# Altium schematic sheet usb.schdoc: USB
size A4; Date: 09.30.2026; CheckedBy: BCY; DrawnBy: miaow; Revision: v1.0.0; SheetNumber: 10; SheetTotal: 18; BoardType: MAIN_PCB; Desc: Power in & USB 0/1
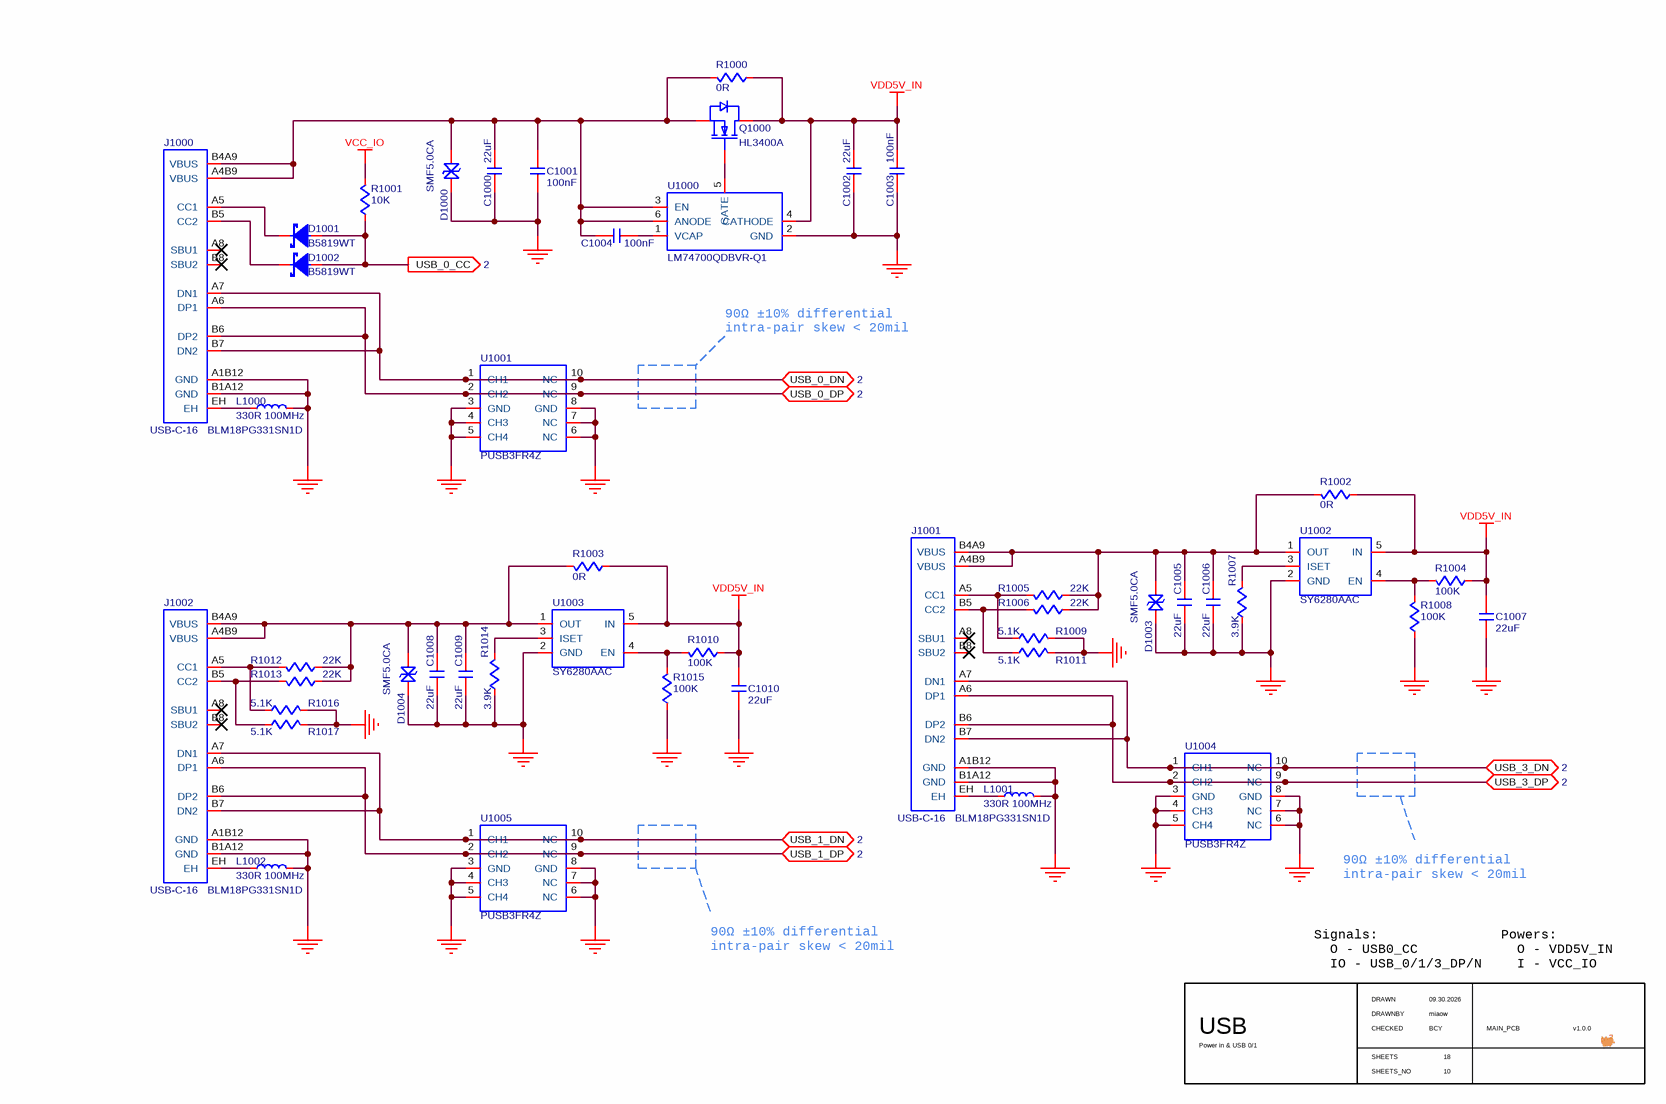
[diagram p0: usb.schdoc]

## Parts
C1000  value 22uF  [C0603]  (hidden comment: C-NOMO)
C1001  value 100nF  [C0402]  (hidden comment: C-NOMO)
C1002  value 22uF  [C0603]  (hidden comment: C-NOMO)
C1003  value 100nF  [C0402]  (hidden comment: C-NOMO)
C1004  value 100nF  [C0402]  (hidden comment: C-NOMO)
C1005  value 22uF  [C0603]  (hidden comment: C-NOMO)
C1006  value 22uF  [C0603]  (hidden comment: C-NOMO)
C1007  value 22uF  [C0603]  (hidden comment: C-NOMO)
C1008  value 22uF  [C0603]  (hidden comment: C-NOMO)
C1009  value 22uF  [C0603]  (hidden comment: C-NOMO)
C1010  value 22uF  [C0603]  (hidden comment: C-NOMO)
D1000  SMF5.0CA  [SMF5.0CA]
D1001  B5819WT  [B5819WT]
D1002  B5819WT  [B5819WT]
D1003  SMF5.0CA  [SMF5.0CA]
D1004  SMF5.0CA  [SMF5.0CA]
J1000  USB-C-16  [USB-C-16]
J1001  USB-C-16  [USB-C-16]
J1002  USB-C-16  [USB-C-16]
L1000  BLM18PG331SN1D  value 330R 100MHz  [L0603]
L1001  BLM18PG331SN1D  value 330R 100MHz  [L0603]
L1002  BLM18PG331SN1D  value 330R 100MHz  [L0603]
Q1000  HL3400A  [HL3400A]
R1000  value 0R  [R1206]  (hidden comment: R)
R1001  value 10K  [R0402]  (hidden comment: R)
R1002  value 0R  [R1206]  (hidden comment: R)
R1003  value 0R  [R1206]  (hidden comment: R)
R1004  value 100K  [R0402]  (hidden comment: R)
R1005  value 22K  [R0402]  (hidden comment: R)
R1006  value 22K  [R0402]  (hidden comment: R)
R1007  value 3.9K  [R0402]  (hidden comment: R)
R1008  value 100K  [R0402]  (hidden comment: R)
R1009  value 5.1K  [R0402]  (hidden comment: R)
R1010  value 100K  [R0402]  (hidden comment: R)
R1011  value 5.1K  [R0402]  (hidden comment: R)
R1012  value 22K  [R0402]  (hidden comment: R)
R1013  value 22K  [R0402]  (hidden comment: R)
R1014  value 3.9K  [R0402]  (hidden comment: R)
R1015  value 100K  [R0402]  (hidden comment: R)
R1016  value 5.1K  [R0402]  (hidden comment: R)
R1017  value 5.1K  [R0402]  (hidden comment: R)
U1000  LM74700QDBVR-Q1  [LM74700QDBVR-Q1]
U1001  PUSB3FR4Z  [PUSB3FR4Z]
U1002  SY6280AAC  [SY6280AAC]
U1003  SY6280AAC  [SY6280AAC]
U1004  PUSB3FR4Z  [PUSB3FR4Z]
U1005  PUSB3FR4Z  [PUSB3FR4Z]

## Ports
USB_0_CC (out, see 2), USB_0_DN (bidir, see 2), USB_0_DP (bidir, see 2), USB_1_DN (bidir, see 2), USB_1_DP (bidir, see 2), USB_3_DN (bidir, see 2), USB_3_DP (bidir, see 2)

## Nets
GND: C1000.1 C1001.2 C1002.1 C1003.2 C1005.1 C1006.1 C1007.2 C1008.1 C1009.1 C1010.2 D1000.1 D1003.1 D1004.1 J1000.A1B12(GND) J1000.B1A12(GND) J1001.A1B12(GND) J1001.B1A12(GND) J1002.A1B12(GND) J1002.B1A12(GND) L1000.2 L1001.2 L1002.2 R1007.2 R1008.2 R1009.1 R1011.1 R1014.2 R1015.2 R1016.1 R1017.1 U1000.2(GND) U1001.3(GND) U1001.4(CH3) U1001.5(CH4) U1001.6(NC) U1001.7(NC) U1001.8(GND) U1002.2(GND) U1003.2(GND) U1004.3(GND) U1004.4(CH3) U1004.5(CH4) U1004.6(NC) U1004.7(NC) U1004.8(GND) U1005.3(GND) U1005.4(CH3) U1005.5(CH4) U1005.6(NC) U1005.7(NC) U1005.8(GND)
VCC_IO: R1001.1
VDD5V_IN: C1002.2 C1003.1 C1007.1 C1010.1 Q1000.D R1000.2 R1002.2 R1003.2 R1004.2 R1010.2 U1000.4(CATHODE) U1002.5(IN) U1003.5(IN)
USB_0_CC: D1001.2 D1002.2 R1001.2 ; port USB_0_CC
USB_0_DN: J1000.A7(DN1) J1000.B7(DN2) U1001.1(CH1) U1001.10(NC) ; port USB_0_DN
USB_0_DP: J1000.A6(DP1) J1000.B6(DP2) U1001.2(CH2) U1001.9(NC) ; port USB_0_DP
USB_1_DN: J1002.A7(DN1) J1002.B7(DN2) U1005.1(CH1) U1005.10(NC) ; port USB_1_DN
USB_1_DP: J1002.A6(DP1) J1002.B6(DP2) U1005.2(CH2) U1005.9(NC) ; port USB_1_DP
USB_3_DN: J1001.A7(DN1) J1001.B7(DN2) U1004.1(CH1) U1004.10(NC) ; port USB_3_DN
USB_3_DP: J1001.A6(DP1) J1001.B6(DP2) U1004.2(CH2) U1004.9(NC) ; port USB_3_DP
NetC1000_2: C1000.2 C1001.1 C1004.2 D1000.2 J1000.A4B9(VBUS) J1000.B4A9(VBUS) Q1000.S R1000.1 U1000.3(EN) U1000.6(ANODE)
NetC1004_1: C1004.1 U1000.1(VCAP)
NetC1005_2: C1005.2 C1006.2 D1003.2 J1001.A4B9(VBUS) J1001.B4A9(VBUS) R1002.1 R1005.2 R1006.2 U1002.1(OUT)
NetC1008_2: C1008.2 C1009.2 D1004.2 J1002.A4B9(VBUS) J1002.B4A9(VBUS) R1003.1 R1012.2 R1013.2 U1003.1(OUT)
NetD1001_1: D1001.1 J1000.A5(CC1)
NetD1002_1: D1002.1 J1000.B5(CC2)
NetJ1000_EH: J1000.EH L1000.1
NetJ1001_A5: J1001.A5(CC1) R1005.1 R1009.2
NetJ1001_B5: J1001.B5(CC2) R1006.1 R1011.2
NetJ1001_EH: J1001.EH L1001.1
NetJ1002_A5: J1002.A5(CC1) R1012.1 R1016.2
NetJ1002_B5: J1002.B5(CC2) R1013.1 R1017.2
NetJ1002_EH: J1002.EH L1002.1
NetQ1000_G: Q1000.G U1000.5(GATE)
NetR1004_1: R1004.1 R1008.1 U1002.4(EN)
NetR1007_1: R1007.1 U1002.3(ISET)
NetR1010_1: R1010.1 R1015.1 U1003.4(EN)
NetR1014_1: R1014.1 U1003.3(ISET)

Not connected (* = marked no-connect by the designer): J1000 A8(SBU1)* B8(SBU2)*; J1001 A8(SBU1)* B8(SBU2)*; J1002 A8(SBU1)* B8(SBU2)*

## Notes on the sheet
- 90Ω ±10% differential
- intra-pair skew < 20mil
- Signals:
  O - USB0_CC
  IO - USB_0/1/3_DP/N
- Powers:
  O - VDD5V_IN
  I - VCC_IO
- DRAWN
- CHECKED
- DRAWNBY
- SHEETS
- SHEETS_NO

## Library data of the parts
C1000 C1002 C1005-C1010 = C-NOMO: voltage: 10V; precision: 20%; Supplier 1: LCSC; Supplier Part Number 1: C2980159
C1001 C1003 C1004 = C-NOMO: voltage: 50V; precision: 10%; Supplier 1: LCSC; Supplier Part Number 1: C307331
D1000 D1003 D1004 = SMF5.0CA: TVS/ESD; Supplier 1: LCSC; Supplier Part Number 1: C19077498
D1001 D1002 = B5819WT: SCHOTTKY; Supplier 1: LCSC; Supplier Part Number 1: C7502714
L1000-L1002 = L: Code_IEC: 1005; Published: 8-Jun-2000; LatestRevisionDate: 29-May-2009; LatestRevisionNote: IPC-7351 Footprint Added.; PackageReference: 0402-A; Publisher: Altium Limited; PackageDescription: Chip Inductor; Code_JEITA: 0402; Supplier 1: LCSC; Supplier Part Number 1: C79913
Q1000 = HL3400A: NMOS; Supplier 1: LCSC; Supplier Part Number 1: C7420348
R1000 R1002 R1003 = R: precision: 30mR; Supplier 1: LCSC; Supplier Part Number 1: C2907363
R1001 R1004-R1017 = R: precision: 1%; Supplier 1: LCSC
  R1001: Supplier Part Number 1: C25744
  R1004 R1008 R1010 R1015: Supplier Part Number 1: C25741
  R1005 R1006 R1012 R1013: Supplier Part Number 1: C25768
  R1007 R1014: Supplier Part Number 1: C51721
  R1009 R1011 R1016 R1017: Supplier Part Number 1: C25905
U1000 = LM74700QDBVR-Q1: IDEAL DIODE; Supplier Part Number 1: C2941042; Supplier 1: LCSC
U1001 U1004 U1005 = PUSB3FR4Z: TVS/ESD - USB, HDMI; Supplier 1: LCSC; Supplier Part Number 1: C503418
U1002 U1003 = SY6280AAC: PWR SWITCH; Supplier 1: LCSC; Supplier Part Number 1: C55136
J1000-J1002 = USB-C-16: Supplier 1: LCSC; Supplier Part Number 1: C165948